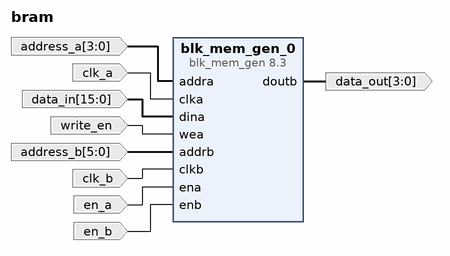
[diagram p0: block diagram of the top level]
# Vivado block design bram, xc7a100tcsg324-1, Vivado 2017.2.1
create_bd_design bram

create_bd_port -dir I -from 3 -to 0 address_a
create_bd_port -dir I -type clk clk_a
create_bd_port -dir I -from 15 -to 0 -type data data_in
create_bd_port -dir I write_en
create_bd_port -dir I -from 5 -to 0 address_b
create_bd_port -dir I -type clk clk_b
create_bd_port -dir O -from 3 -to 0 -type data data_out
create_bd_port -dir I en_a
create_bd_port -dir I en_b

create_bd_cell -type ip -vlnv xilinx.com:ip:blk_mem_gen:8.3 blk_mem_gen_0
set_property -dict [list \
  CONFIG.Memory_Type Simple_Dual_Port_RAM \
  CONFIG.Enable_32bit_Address false \
  CONFIG.Use_Byte_Write_Enable false \
  CONFIG.Write_Width_A 16 \
  CONFIG.Write_Depth_A 16 \
  CONFIG.Operating_Mode_A WRITE_FIRST \
  CONFIG.Write_Width_B 4 \
  CONFIG.Read_Width_B 4 \
  CONFIG.Enable_B Use_ENB_Pin \
  CONFIG.Register_PortB_Output_of_Memory_Primitives true \
  CONFIG.Load_Init_File true \
  CONFIG.Coe_File ../../../bram_blk_mem_gen_0_0.coe \
  CONFIG.Port_B_Clock 100 \
  CONFIG.Port_B_Enable_Rate 100 \
  CONFIG.use_bram_block Stand_Alone \
] [get_bd_cells blk_mem_gen_0]

# ---- connections ----

connect_bd_net [get_bd_ports address_a] [get_bd_pins blk_mem_gen_0/addra]
connect_bd_net [get_bd_ports clk_a] [get_bd_pins blk_mem_gen_0/clka]
connect_bd_net [get_bd_ports data_in] [get_bd_pins blk_mem_gen_0/dina]
connect_bd_net [get_bd_ports write_en] [get_bd_pins blk_mem_gen_0/wea]
connect_bd_net [get_bd_ports address_b] [get_bd_pins blk_mem_gen_0/addrb]
connect_bd_net [get_bd_ports clk_b] [get_bd_pins blk_mem_gen_0/clkb]
connect_bd_net [get_bd_pins blk_mem_gen_0/doutb] [get_bd_ports data_out]
connect_bd_net [get_bd_ports en_a] [get_bd_pins blk_mem_gen_0/ena]
connect_bd_net [get_bd_ports en_b] [get_bd_pins blk_mem_gen_0/enb]

validate_bd_design
save_bd_design
